# Altium project Lily.PrjPcb
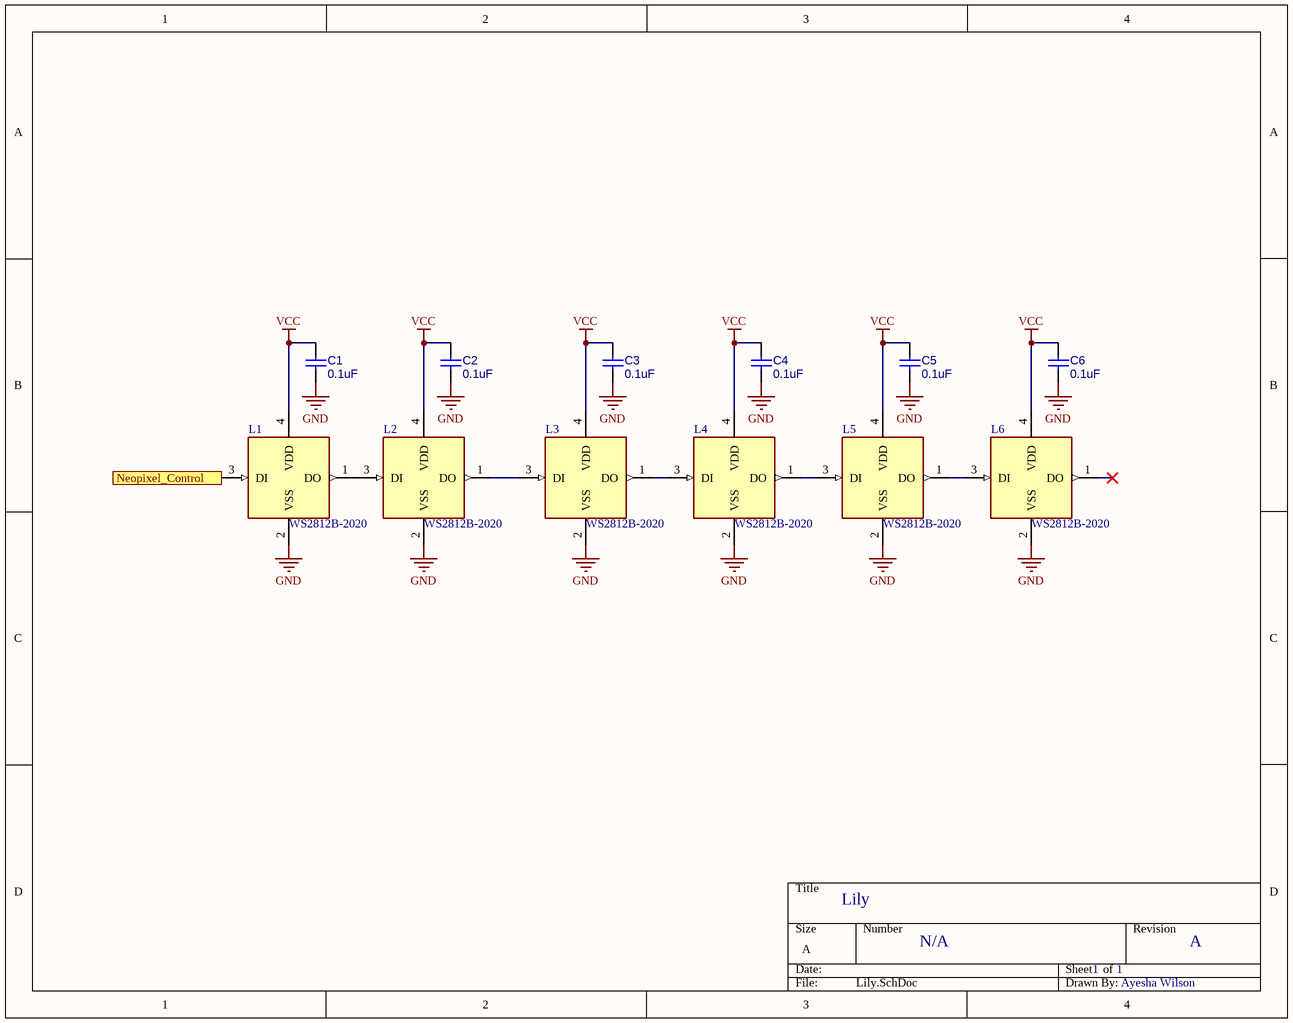
[diagram p0: Lily.SchDoc]
1 sheet, 12 parts. Net scope: flat (ports and power ports of the same name join across sheets).
Board file: Lily.PcbDoc

## Sheet Lily.SchDoc
size A; SheetNumber: 1; SheetTotal: 1

### Parts
C1  value 0.1uF  [CC1005-0402]  (hidden comment: Cap-NP)
C2  value 0.1uF  [CC1005-0402]  (hidden comment: Cap-NP)
C3  value 0.1uF  [CC1005-0402]  (hidden comment: Cap-NP)
C4  value 0.1uF  [CC1005-0402]  (hidden comment: Cap-NP)
C5  value 0.1uF  [CC1005-0402]  (hidden comment: Cap-NP)
C6  value 0.1uF  [CC1005-0402]  (hidden comment: Cap-NP)
L1  WS2812B-2020  [WS2812B-2020]
L2  WS2812B-2020  [WS2812B-2020]
L3  WS2812B-2020  [WS2812B-2020]
L4  WS2812B-2020  [WS2812B-2020]
L5  WS2812B-2020  [WS2812B-2020]
L6  WS2812B-2020  [WS2812B-2020]

### Ports
Neopixel_Control

### Nets
GND: C1.2 C2.2 C3.2 C4.2 C5.2 C6.2 L1.2(VSS) L2.2(VSS) L3.2(VSS) L4.2(VSS) L5.2(VSS) L6.2(VSS)
VCC: C1.1 C2.1 C3.1 C4.1 C5.1 C6.1 L1.4(VDD) L2.4(VDD) L3.4(VDD) L4.4(VDD) L5.4(VDD) L6.4(VDD)
NetL1_1: L1.1(DO) L2.3(DI)
NetL1_3: L1.3(DI) ; port Neopixel_Control
NetL2_1: L2.1(DO) L3.3(DI)
NetL3_1: L3.1(DO) L4.3(DI)
NetL4_1: L4.1(DO) L5.3(DI)
NetL5_1: L5.1(DO) L6.3(DI)

Not connected (* = marked no-connect by the designer): L6 1(DO)*

### Notes on the sheet
- Lily
- N/A
- 1
- A
- Ayesha Wilson

### Library data of the parts
C1-C6 = Cap-NP: CAP,CER,4.7UF,10%,25V,X5R,0805
L1-L6 = WS2812B-2020: LED; SMD; 2020; RGB; 2x2x0.84mm; 3.7Ã·5.3V; Lens: transparent; 2kHz; MF: WorldSemi; MP: WS2812B2020; Package: None; Price: None; Availability: In Stock; Check_prices: https://www.snapeda.com/parts/WS2812B2020/Worldsemi/view-part/?ref=eda; SnapEDA_Link: https://www.snapeda.com/parts/WS2812B2020/Worldsemi/view-part/?ref=snap; Value: *